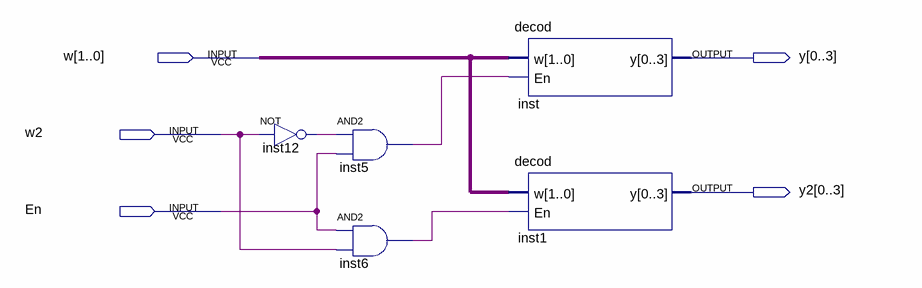
[diagram p0: schematic sheet]
// Quartus schematic decodModified4x16.bdf as structural Verilog: 5 symbols, 5 pins
module decodModified4x16 (
  input  [1:0] w,
  input  w2,
  input  En,
  output [0:3] y,
  output [0:3] y2
);

  wire inst5_out, inst6_out, inst12_out;

  not inst12 (inst12_out, w2);
  and inst5 (inst5_out, inst12_out, En);
  and inst6 (inst6_out, En, w2);
  decod inst (.w(w), .En(inst5_out), .y(y));
  decod inst1 (.w(w), .En(inst6_out), .y(y2));
endmodule
